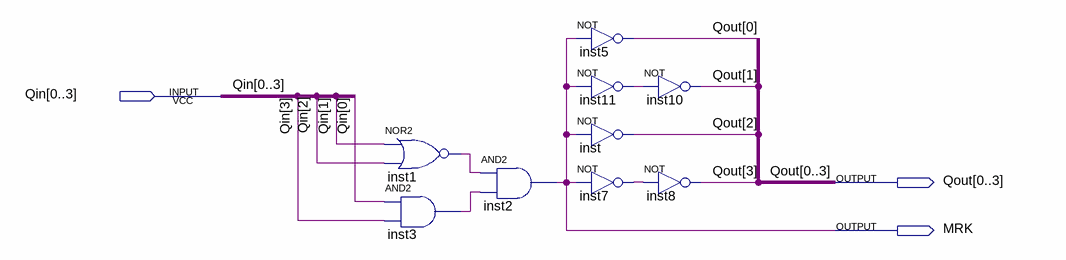
[diagram p0: schematic sheet]
// Quartus schematic MRK_equally_NINE.bdf as structural Verilog: 9 symbols, 3 pins
module MRK_equally_NINE (
  input  [0:3] Qin,
  output [0:3] Qout,
  output MRK
);

  wire inst1_out, inst3_out, inst7_out, inst11_out;

  nor inst1 (inst1_out, Qin[1], Qin[2]);
  and inst3 (inst3_out, Qin[0], Qin[3]);
  and inst2 (MRK, inst1_out, inst3_out);
  not inst5 (Qout[0], MRK);
  not inst11 (inst11_out, MRK);
  not inst (Qout[2], MRK);
  not inst7 (inst7_out, MRK);
  not inst10 (Qout[1], inst11_out);
  not inst8 (Qout[3], inst7_out);
endmodule
